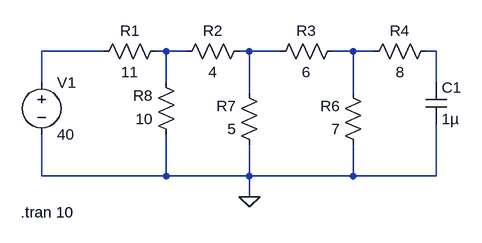
[diagram p0: schematic EC-291.asc]
EC-291.asc, the LTspice schematic file:
Version 4
SHEET 1 880 680
WIRE 0 112 -96 112
WIRE 96 112 80 112
WIRE 128 112 96 112
WIRE 224 112 208 112
WIRE 272 112 224 112
WIRE 384 112 352 112
WIRE 416 112 384 112
WIRE 512 112 496 112
WIRE -96 160 -96 112
WIRE 96 160 96 112
WIRE 512 160 512 112
WIRE 224 176 224 112
WIRE 384 176 384 112
WIRE -96 304 -96 240
WIRE 96 304 96 240
WIRE 96 304 -96 304
WIRE 224 304 224 256
WIRE 224 304 96 304
WIRE 384 304 384 256
WIRE 384 304 224 304
WIRE 512 304 512 224
WIRE 512 304 384 304
WIRE 224 336 224 304
FLAG 224 336 0
SYMBOL res 96 96 R90
WINDOW 0 0 56 VBottom 2
WINDOW 3 32 56 VTop 2
SYMATTR InstName R1
SYMATTR Value 11
SYMBOL res 224 96 R90
WINDOW 0 0 56 VBottom 2
WINDOW 3 32 56 VTop 2
SYMATTR InstName R2
SYMATTR Value 4
SYMBOL res 368 96 R90
WINDOW 0 0 56 VBottom 2
WINDOW 3 32 56 VTop 2
SYMATTR InstName R3
SYMATTR Value 6
SYMBOL res 512 96 R90
WINDOW 0 0 56 VBottom 2
WINDOW 3 32 56 VTop 2
SYMATTR InstName R4
SYMATTR Value 8
SYMBOL res 400 272 R180
WINDOW 0 36 76 Left 2
WINDOW 3 36 40 Left 2
SYMATTR InstName R6
SYMATTR Value 7
SYMBOL res 240 272 R180
WINDOW 0 36 76 Left 2
WINDOW 3 36 40 Left 2
SYMATTR InstName R7
SYMATTR Value 5
SYMBOL res 112 256 R180
WINDOW 0 36 76 Left 2
WINDOW 3 36 40 Left 2
SYMATTR InstName R8
SYMATTR Value 10
SYMBOL voltage -96 144 R0
WINDOW 123 0 0 Left 2
WINDOW 39 0 0 Left 2
SYMATTR InstName V1
SYMATTR Value 40
SYMBOL cap 496 160 R0
SYMATTR InstName C1
SYMATTR Value 1µ
TEXT -128 360 Left 2 !.tran 10

The netlist it stands for:
* EC-291.asc
R1 N002 N001 11
R2 N003 N002 4
R3 N004 N003 6
R4 N005 N004 8
R6 0 N004 7
R7 0 N003 5
R8 0 N002 10
V1 N001 0 40
C1 N005 0 1µ
.tran 10
.backanno
.end